# EAGLE schematic ReSpeaker 4-Mic Array for Raspberry Pi  v1.0 (EAGLE 6.4)

## Sheet 1 of 4
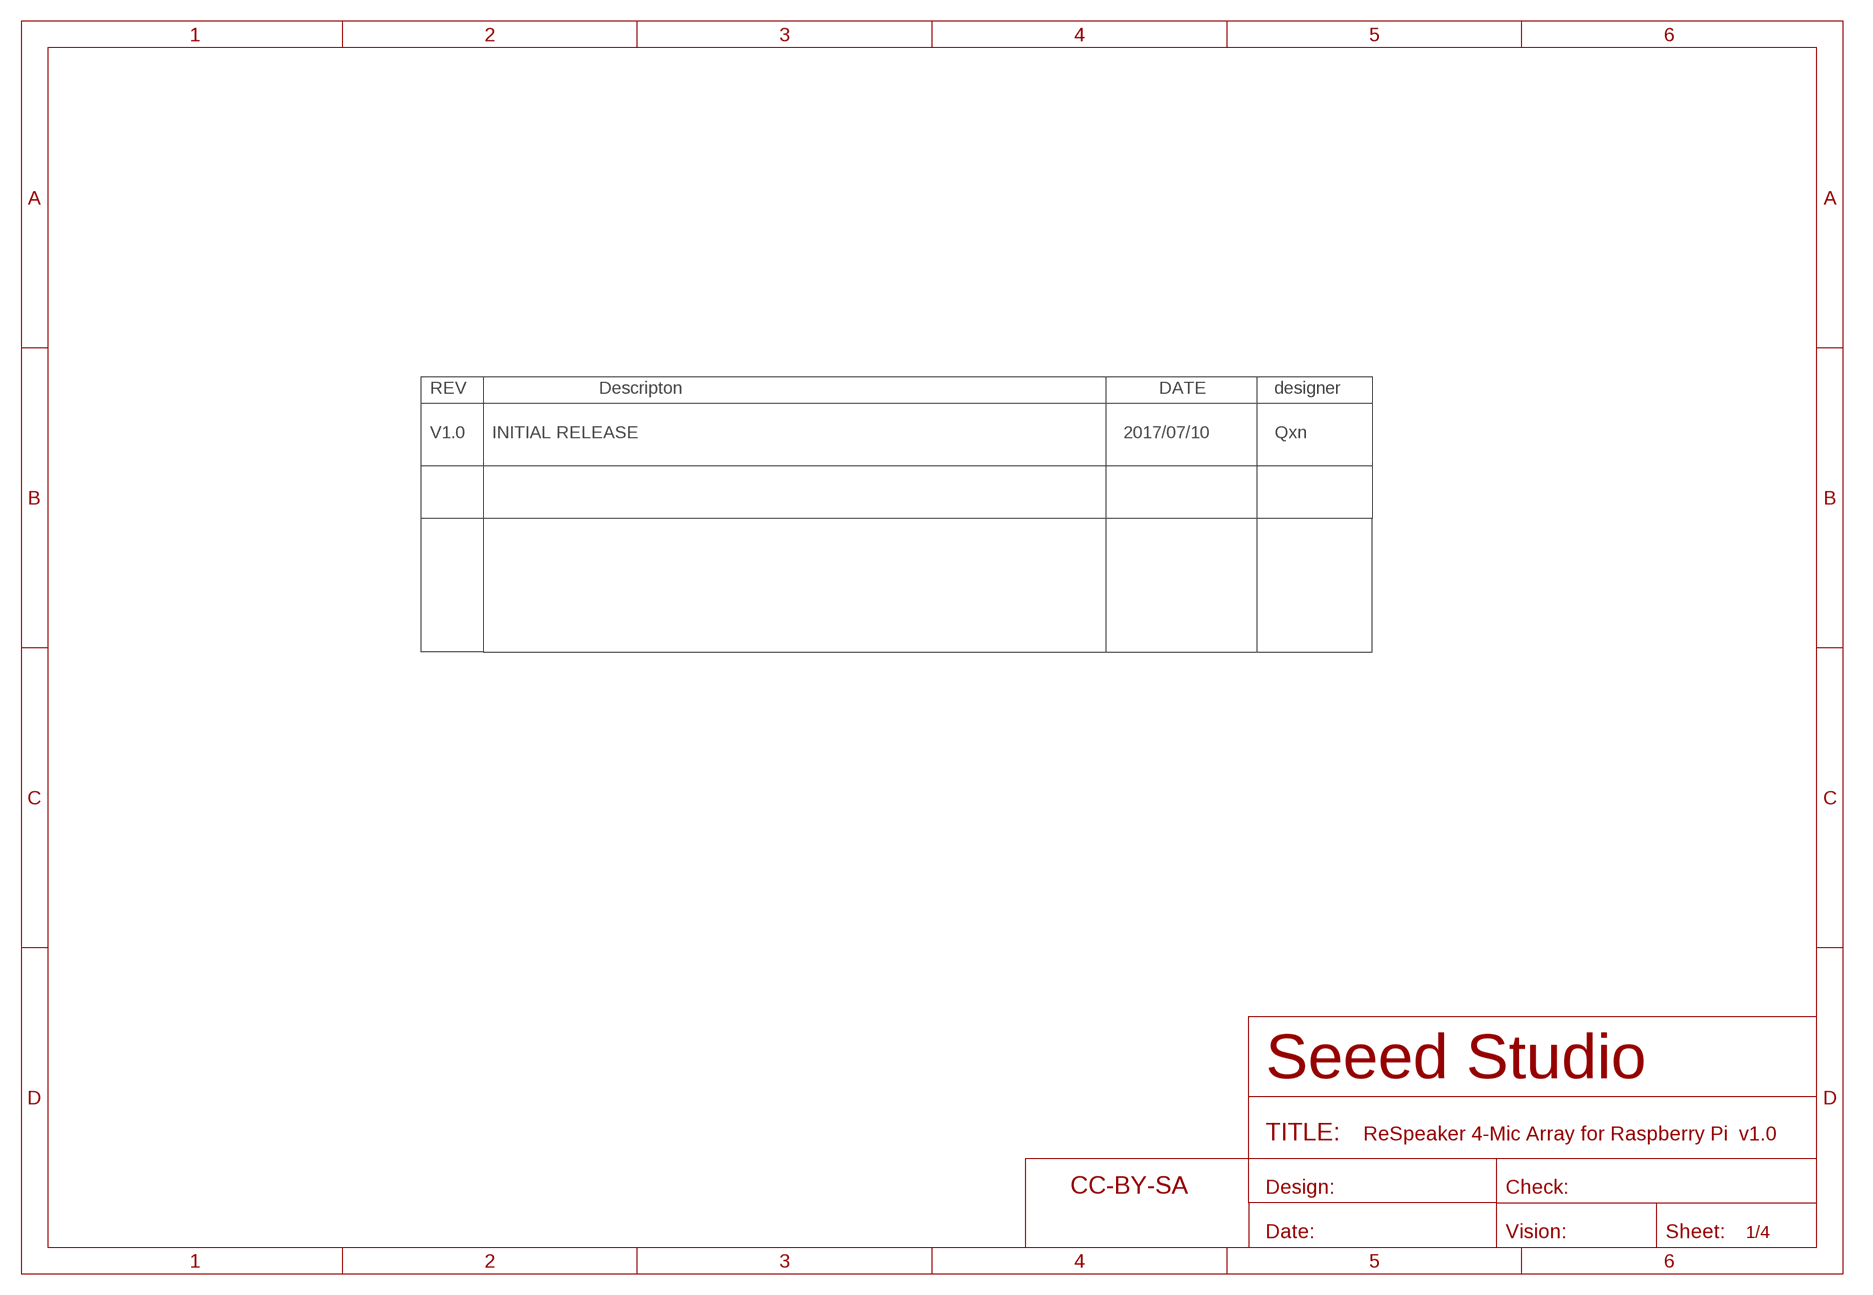
[diagram p0: schematic, sheet 1]

### Parts
FR4  SEEEDSTUDIO-OPEN-SCH-FRAME  [SEEEDSTUDIO-PCB-FRAME]

### Notes on the sheet
- REV | Descripton | DATE | designer
- V1.0 | INITIAL RELEASE | 2017/07/10 | Qxn

## Sheet 2 of 4
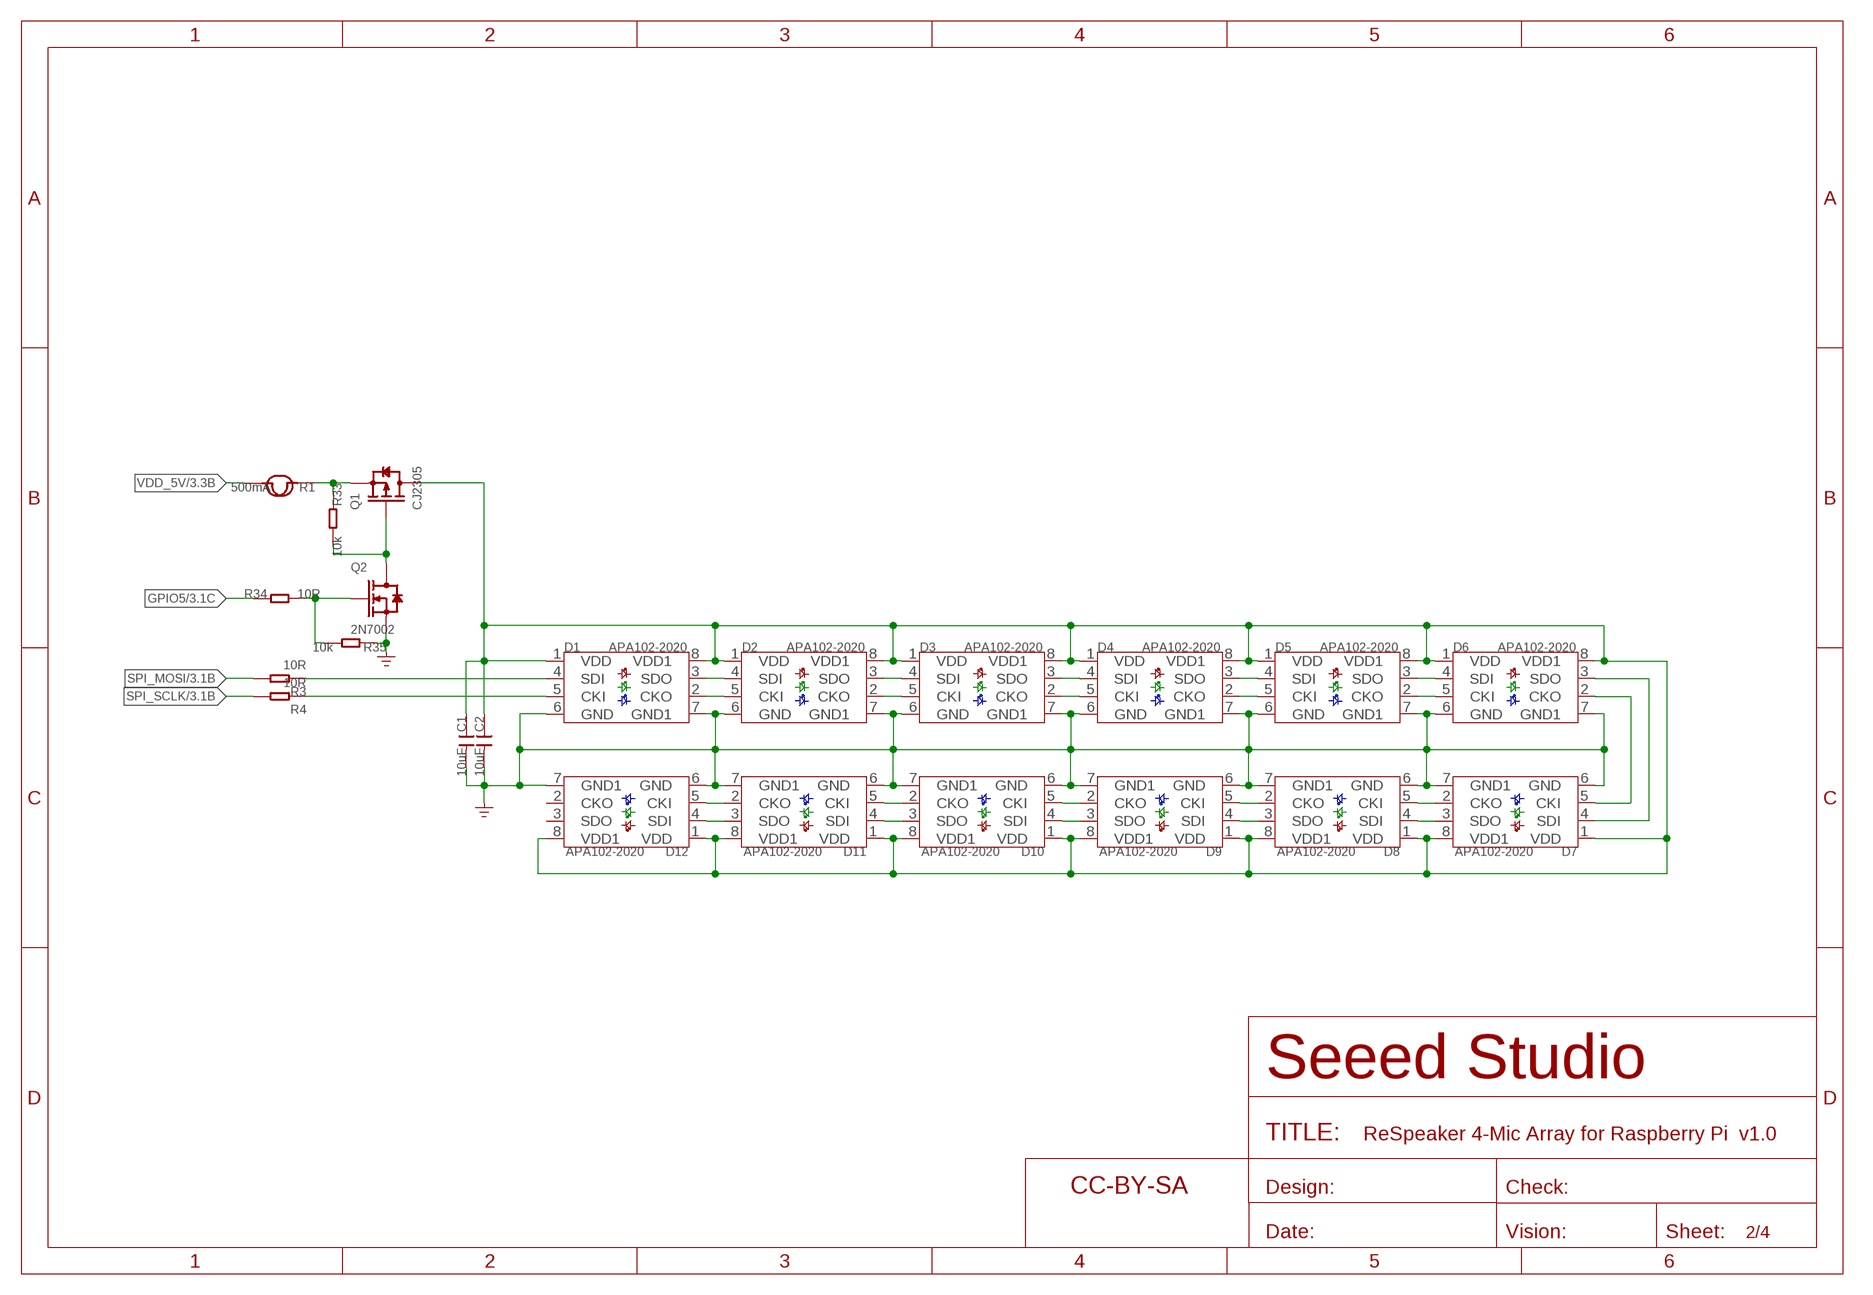
[diagram p1: schematic, sheet 2]

### Parts
C1  10uF  CAP-0603  [C0603]
C2  10uF  CAP-0603  [C0603]
D1  APA102-2020  LED-RGB-8P-APA102-2020  [RGB2020]
D2  APA102-2020  LED-RGB-8P-APA102-2020  [RGB2020]
D3  APA102-2020  LED-RGB-8P-APA102-2020  [RGB2020]
D4  APA102-2020  LED-RGB-8P-APA102-2020  [RGB2020]
D5  APA102-2020  LED-RGB-8P-APA102-2020  [RGB2020]
D6  APA102-2020  LED-RGB-8P-APA102-2020  [RGB2020]
D7  APA102-2020  LED-RGB-8P-APA102-2020  [RGB2020]
D8  APA102-2020  LED-RGB-8P-APA102-2020  [RGB2020]
D9  APA102-2020  LED-RGB-8P-APA102-2020  [RGB2020]
D10  APA102-2020  LED-RGB-8P-APA102-2020  [RGB2020]
D11  APA102-2020  LED-RGB-8P-APA102-2020  [RGB2020]
D12  APA102-2020  LED-RGB-8P-APA102-2020  [RGB2020]
FR3  SEEEDSTUDIO-OPEN-SCH-FRAME  [SEEEDSTUDIO-PCB-FRAME]
Q1  CJ2305  MOSFET-P'SI2323CDS/SI2305DS<BR>'  [SOT-23]
Q2  2N7002  MOSFET-N'SOT23'  [SOT-23]
R1  500mA  FUSE+'1206'  [FS1206]
R3  10R  RES-0402  [R0402]
R4  10R  RES-0402  [R0402]
R33  10k  RES-0402  [R0402]
R34  10R  RES-0402  [R0402]
R35  10k  RES-0402  [R0402]

### Nets
GND: C1.2 C2.2 D1.6(GND) D1.7(GND1) D2.6(GND) D2.7(GND1) D3.6(GND) D3.7(GND1) D4.6(GND) D4.7(GND1) D5.6(GND) D5.7(GND1) D6.6(GND) D6.7(GND1) D7.6(GND) D7.7(GND1) D8.6(GND) D8.7(GND1) D9.6(GND) D9.7(GND1) D10.6(GND) D10.7(GND1) D11.6(GND) D11.7(GND1) D12.6(GND) D12.7(GND1) Q2.2(S) R35.1 ; supply symbol labelled GND_POWER ; also sheet 3,4
GPIO5: R34.1 ; also sheet 3
N$1: D1.2(CKO) D2.5(CKI)
N$2: D1.4(SDI) R3.1
N$4: D1.3(SDO) D2.4(SDI)
N$5: D1.5(CKI) R4.1
N$8: D2.2(CKO) D3.5(CKI)
N$11: D2.3(SDO) D3.4(SDI)
N$15: D3.2(CKO) D4.5(CKI)
N$17: D4.2(CKO) D5.5(CKI)
N$19: D3.3(SDO) D4.4(SDI)
N$22: D4.3(SDO) D5.4(SDI)
N$23: D5.2(CKO) D6.5(CKI)
N$25: D5.3(SDO) D6.4(SDI)
N$26: D6.2(CKO) D7.5(CKI)
N$27: D6.3(SDO) D7.4(SDI)
N$28: D7.2(CKO) D8.5(CKI)
N$29: D7.3(SDO) D8.4(SDI)
N$53: D8.2(CKO) D9.5(CKI)
N$54: D8.3(SDO) D9.4(SDI)
N$55: D9.2(CKO) D10.5(CKI)
N$56: D9.3(SDO) D10.4(SDI)
N$57: Q1.2(S) R1.1 R33.1
N$58: Q1.1(G) Q2.3(D) R33.2
N$59: D10.2(CKO) D11.5(CKI)
N$60: D10.3(SDO) D11.4(SDI)
N$61: D11.2(CKO) D12.5(CKI)
N$62: D11.3(SDO) D12.4(SDI)
N$63: Q2.1(G) R34.2 R35.2
SPI_MOSI: R3.2 ; also sheet 3
SPI_SCLK: R4.2 ; also sheet 3
VDD_5V: R1.2 ; also sheet 3,4
VDD_LED: C1.1 C2.1 D1.1(VDD) D1.8(VDD1) D2.1(VDD) D2.8(VDD1) D3.1(VDD) D3.8(VDD1) D4.1(VDD) D4.8(VDD1) D5.1(VDD) D5.8(VDD1) D6.1(VDD) D6.8(VDD1) D7.1(VDD) D7.8(VDD1) D8.1(VDD) D8.8(VDD1) D9.1(VDD) D9.8(VDD1) D10.1(VDD) D10.8(VDD1) D11.1(VDD) D11.8(VDD1) D12.1(VDD) D12.8(VDD1) Q1.3(D)
Unconnected: D12.2(CKO) D12.3(SDO)

## Sheet 3 of 4
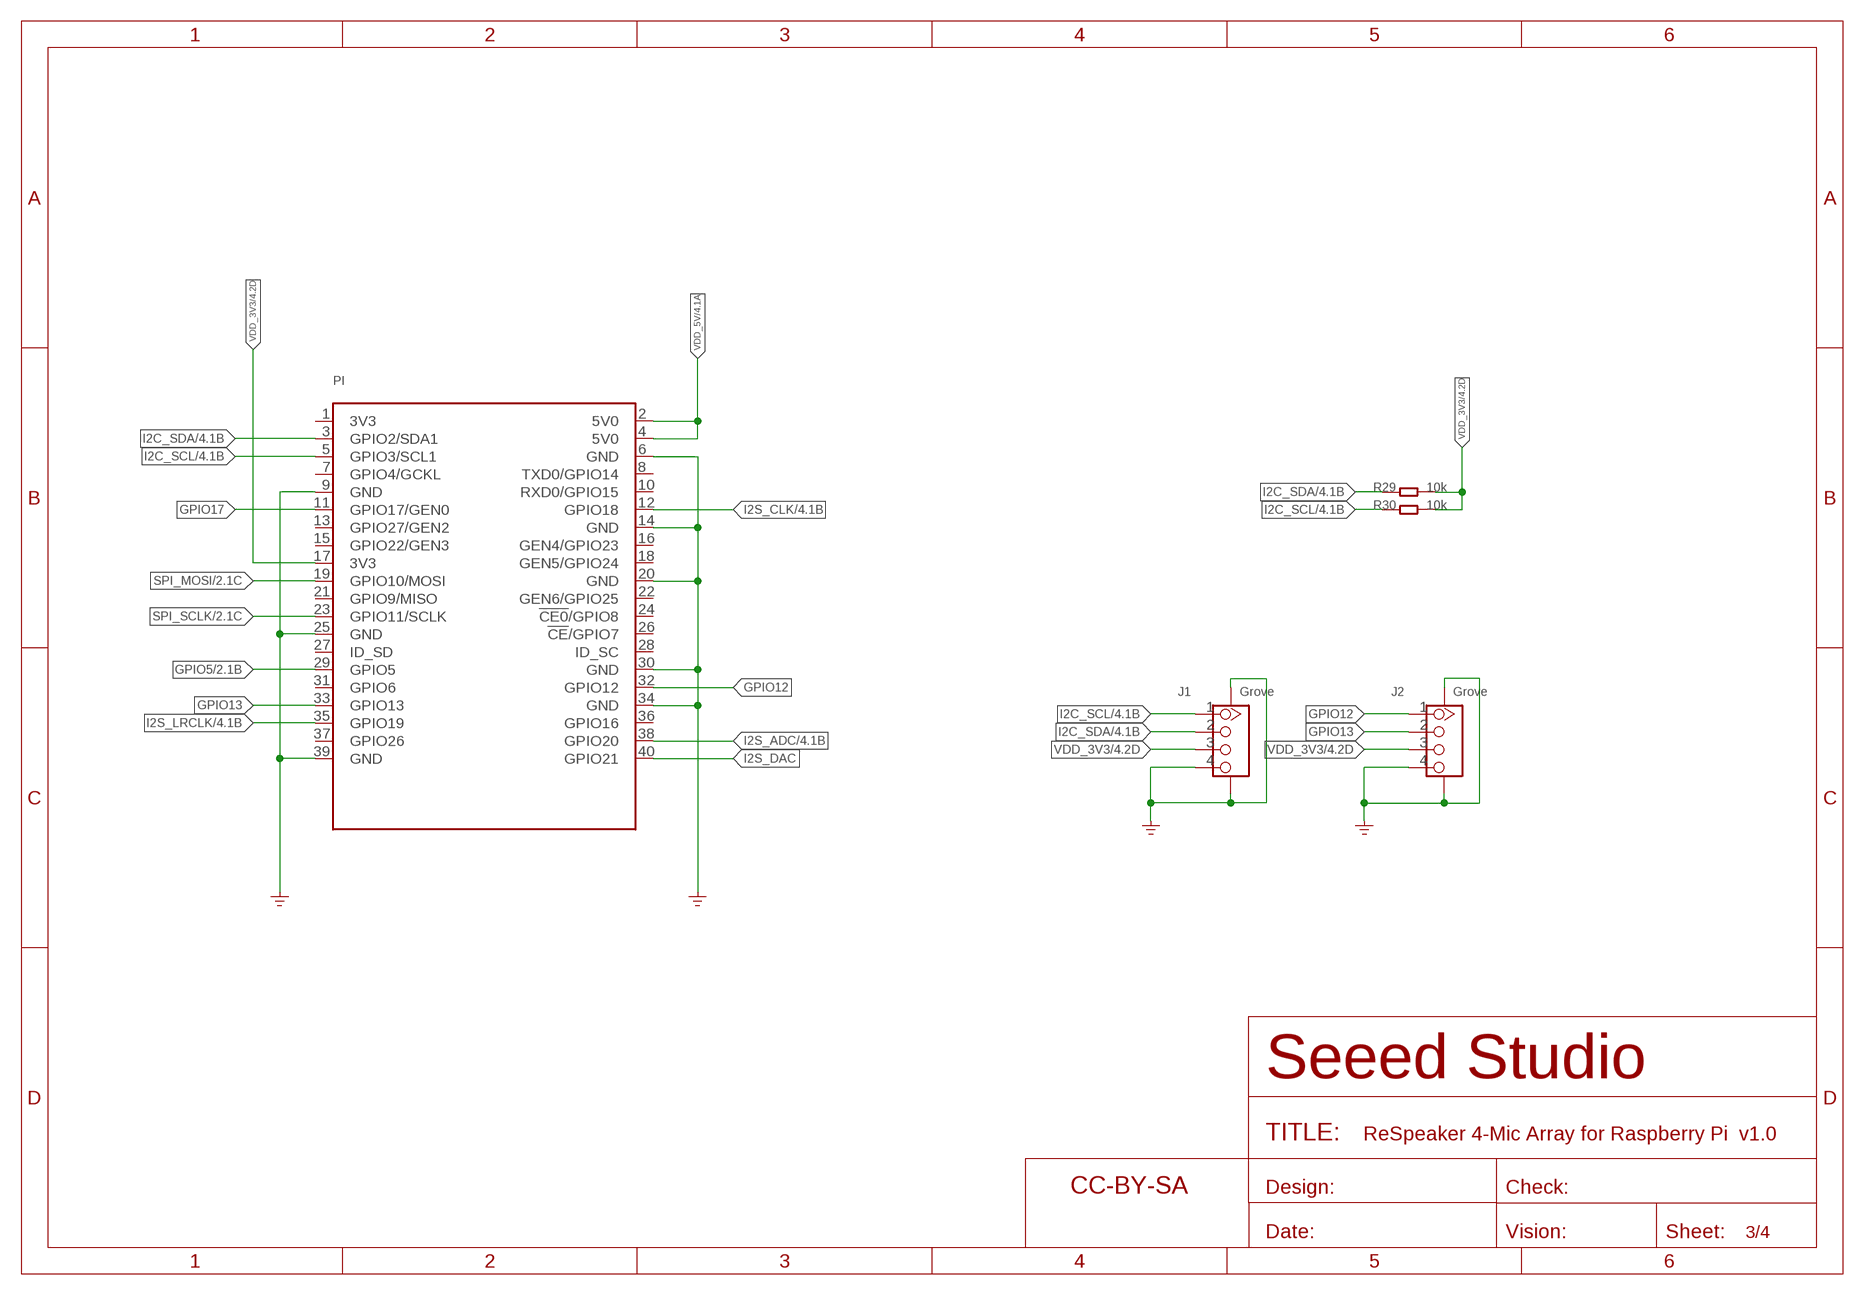
[diagram p2: schematic, sheet 3]

### Parts
FR1  SEEEDSTUDIO-OPEN-SCH-FRAME  [SEEEDSTUDIO-PCB-FRAME]
J1  Grove  GROVE-CONNECTOR-SMD'90D'  [HW4-SMD-2.0-90D]
J2  Grove  GROVE-CONNECTOR-SMD'90D'  [HW4-SMD-2.0-90D]
PI  RPI-ZERO-BOTTOM  [H2X20-SMD-2.54]
R29  10k  RES-0402  [R0402]
R30  10k  RES-0402  [R0402]

### Nets
GND: J1.4 J1.SS1 J1.SS2 J2.4 J2.SS1 J2.SS2 PI.6(GND) PI.9(GND) PI.14(GND) PI.20(GND) PI.25(GND) PI.30(GND) PI.34(GND) PI.39(GND) ; supply symbol labelled GND_POWER ; also sheet 2,4
GPIO5: PI.29(GPIO5) ; also sheet 2
GPIO12: J2.1 PI.32(GPIO12)
GPIO13: J2.2 PI.33(GPIO13)
GPIO17: PI.11(GPIO17/GEN0)
I2C_SCL: J1.1 PI.5(GPIO3/SCL1) R30.1 ; also sheet 4
I2C_SDA: J1.2 PI.3(GPIO2/SDA1) R29.1 ; also sheet 4
I2S_ADC: PI.38(GPIO20) ; also sheet 4
I2S_CLK: PI.12(GPIO18) ; also sheet 4
I2S_DAC: PI.40(GPIO21)
I2S_LRCLK: PI.35(GPIO19) ; also sheet 4
SPI_MOSI: PI.19(GPIO10/MOSI) ; also sheet 2
SPI_SCLK: PI.23(GPIO11/SCLK) ; also sheet 2
VDD_3V3: J1.3 J2.3 PI.17(3V3) R29.2 R30.2 ; also sheet 4
VDD_5V: PI.2(5V0) PI.4(5V0) ; also sheet 2,4
Unconnected: PI.1(3V3) PI.7(GPIO4/GCKL) PI.8(TXD0/GPIO14) PI.10(RXD0/GPIO15) PI.13(GPIO27/GEN2) PI.15(GPIO22/GEN3) PI.16(GEN4/GPIO23) PI.18(GEN5/GPIO24) PI.21(GPIO9/MISO) PI.22(GEN6/GPIO25) PI.24(!CE0!/GPIO8) PI.26(!CE!/GPIO7) PI.27(ID_SD) PI.28(ID_SC) PI.31(GPIO6) PI.36(GPIO16) PI.37(GPIO26)

## Sheet 4 of 4
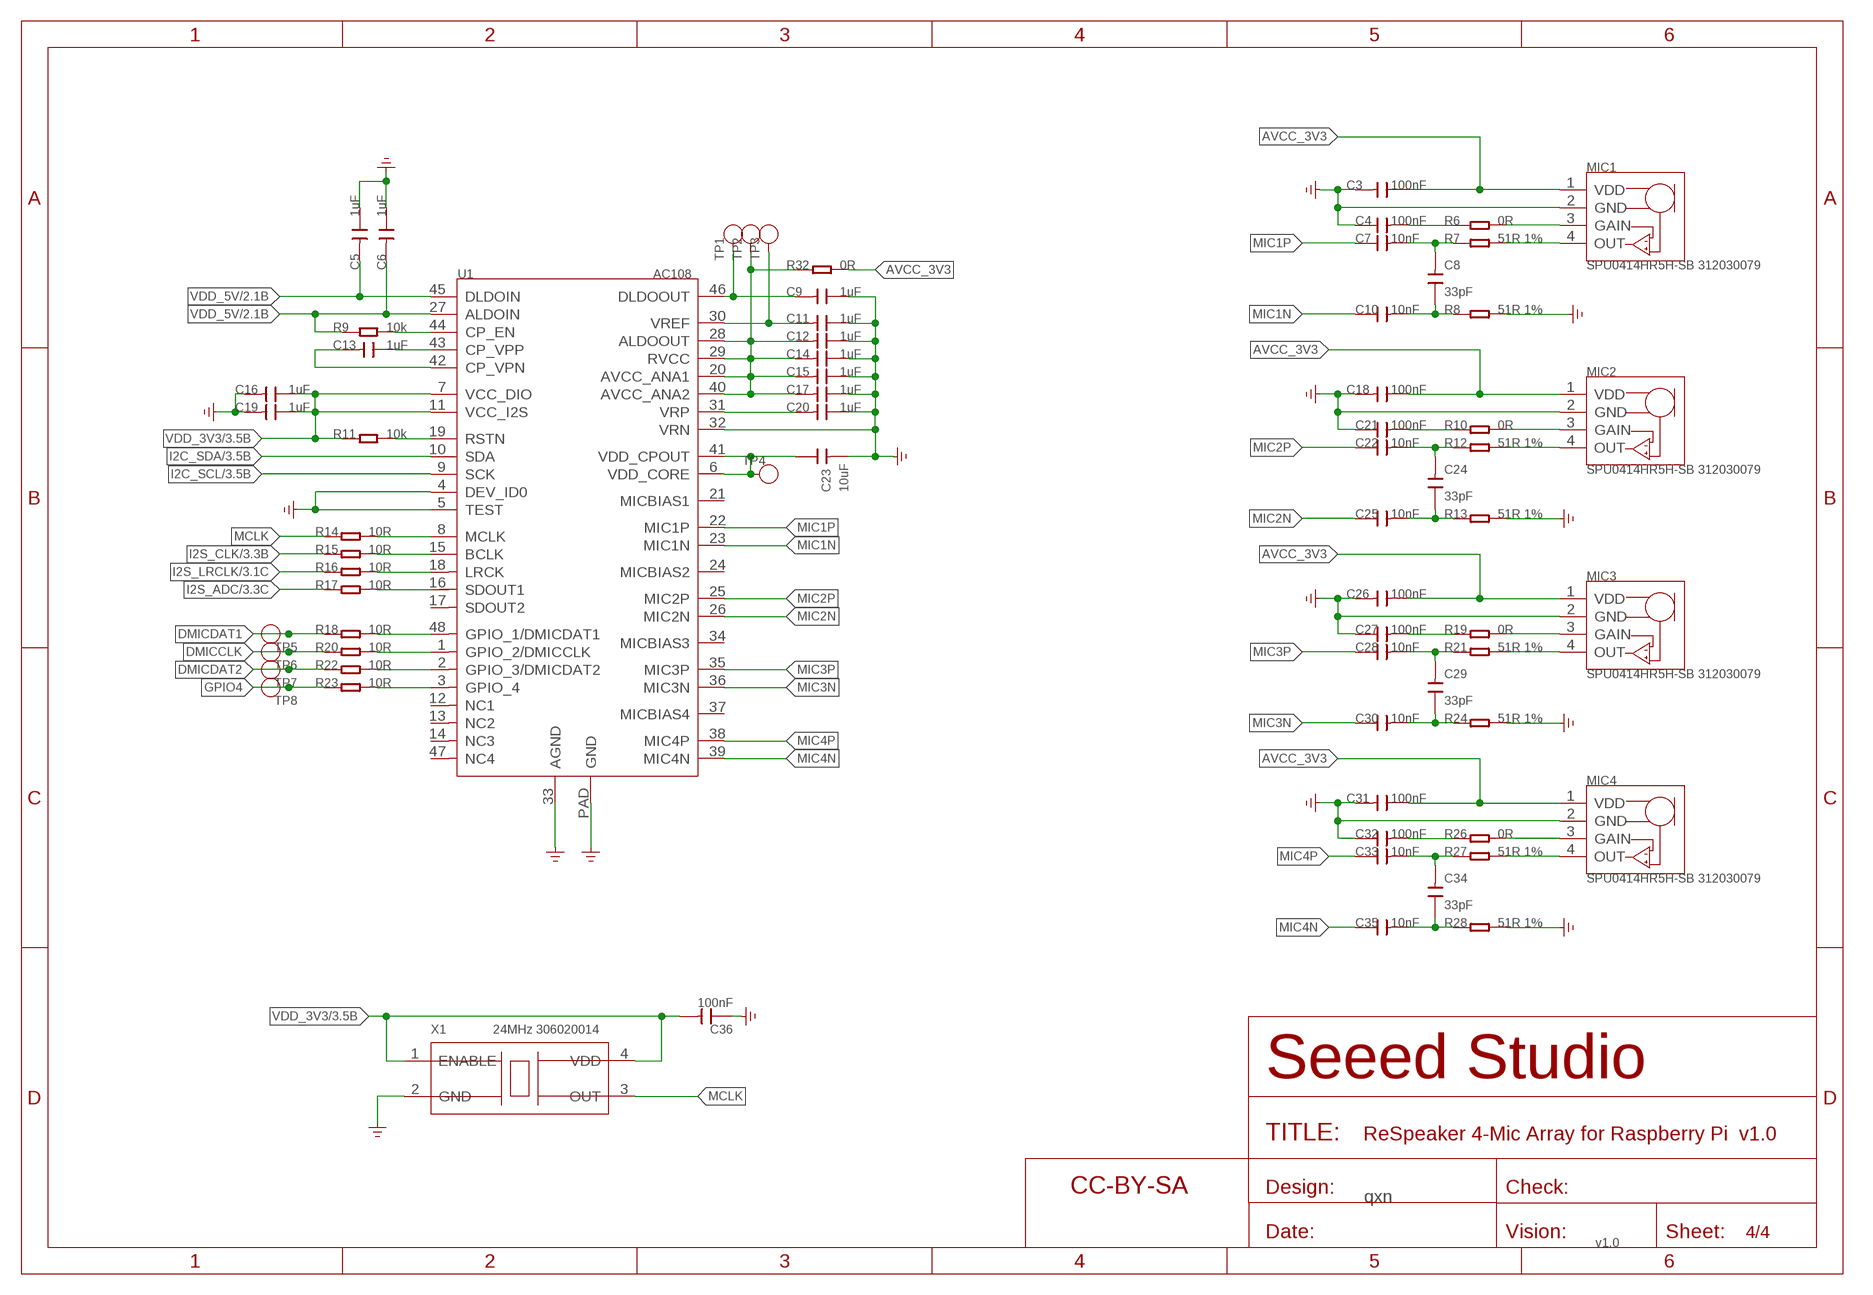
[diagram p3: schematic, sheet 4]

### Parts
C3  100nF  CAP-0402  [C0402]
C4  100nF  CAP-0402  [C0402]
C5  1uF  CAP-0402  [C0402]
C6  1uF  CAP-0402  [C0402]
C7  10nF  CAP-0402  [C0402]
C8  33pF  CAP-0402  [C0402]
C9  1uF  CAP-0402  [C0402]
C10  10nF  CAP-0402  [C0402]
C11  1uF  CAP-0402  [C0402]
C12  1uF  CAP-0402  [C0402]
C13  1uF  CAP-0402  [C0402]
C14  1uF  CAP-0402  [C0402]
C15  1uF  CAP-0402  [C0402]
C16  1uF  CAP-0402  [C0402]
C17  1uF  CAP-0402  [C0402]
C18  100nF  CAP-0402  [C0402]
C19  1uF  CAP-0402  [C0402]
C20  1uF  CAP-0402  [C0402]
C21  100nF  CAP-0402  [C0402]
C22  10nF  CAP-0402  [C0402]
C23  10uF  CAP-0603  [C0603]
C24  33pF  CAP-0402  [C0402]
C25  10nF  CAP-0402  [C0402]
C26  100nF  CAP-0402  [C0402]
C27  100nF  CAP-0402  [C0402]
C28  10nF  CAP-0402  [C0402]
C29  33pF  CAP-0402  [C0402]
C30  10nF  CAP-0402  [C0402]
C31  100nF  CAP-0402  [C0402]
C32  100nF  CAP-0402  [C0402]
C33  10nF  CAP-0402  [C0402]
C34  33pF  CAP-0402  [C0402]
C35  10nF  CAP-0402  [C0402]
C36  100nF  CAP-0402  [C0402]
FR2  SEEEDSTUDIO-OPEN-SCH-FRAME  [SEEEDSTUDIO-PCB-FRAME]
MIC1  SPU0414HR5H-SB 312030079  MICROPHONE-SPU0414HR5H-SB  [MIC4P-1.7-3.76X2.95X1.1MM]
MIC2  SPU0414HR5H-SB 312030079  MICROPHONE-SPU0414HR5H-SB  [MIC4P-1.7-3.76X2.95X1.1MM]
MIC3  SPU0414HR5H-SB 312030079  MICROPHONE-SPU0414HR5H-SB  [MIC4P-1.7-3.76X2.95X1.1MM]
MIC4  SPU0414HR5H-SB 312030079  MICROPHONE-SPU0414HR5H-SB  [MIC4P-1.7-3.76X2.95X1.1MM]
R6  0R  RES-0402  [R0402]
R7  51R 1%  RES-0402  [R0402]
R8  51R 1%  RES-0402  [R0402]
R9  10k  RES-0402  [R0402]
R10  0R  RES-0402  [R0402]
R11  10k  RES-0402  [R0402]
R12  51R 1%  RES-0402  [R0402]
R13  51R 1%  RES-0402  [R0402]
R14  10R  RES-0402  [R0402]
R15  10R  RES-0402  [R0402]
R16  10R  RES-0402  [R0402]
R17  10R  RES-0402  [R0402]
R18  10R  RES-0402  [R0402]
R19  0R  RES-0402  [R0402]
R20  10R  RES-0402  [R0402]
R21  51R 1%  RES-0402  [R0402]
R22  10R  RES-0402  [R0402]
R23  10R  RES-0402  [R0402]
R24  51R 1%  RES-0402  [R0402]
R26  0R  RES-0402  [R0402]
R27  51R 1%  RES-0402  [R0402]
R28  51R 1%  RES-0402  [R0402]
R32  0R  RES-0402  [R0402]
TP1  TEST-POINT'4545'  [TP-D45MIL]
TP2  TEST-POINT'4545'  [TP-D45MIL]
TP3  TEST-POINT'4545'  [TP-D45MIL]
TP4  TEST-POINT'4545'  [TP-D45MIL]
TP5  TEST-POINT'4080'  [TP-80X40MIL]
TP6  TEST-POINT'4080'  [TP-80X40MIL]
TP7  TEST-POINT'4080'  [TP-80X40MIL]
TP8  TEST-POINT'4080'  [TP-80X40MIL]
U1  AC108  CONVERTER-ADC-AC108  [QFN48G-0.4-6X6MM]
X1  24MHz 306020014  CRYSTAL-OSCILLATOR2.5*2.0  [OSC4-SMD-2.5X2.0X0.8MM]

### Nets
ALDO: C12.2 C14.2 C15.2 C17.2 R32.2 TP2.T U1.20(AVCC_ANA1) U1.28(ALDOOUT) U1.29(RVCC) U1.40(AVCC_ANA2)
AVCC_3V3: C3.1 C18.1 C26.1 C31.1 MIC1.1(VDD) MIC2.1(VDD) MIC3.1(VDD) MIC4.1(VDD) R32.1
DMICCLK: R20.2 TP6.1(T)
DMICDAT1: R18.2 TP5.1(T)
DMICDAT2: R22.2 TP7.1(T)
GND: C3.2 C4.1 C5.1 C6.1 C9.1 C11.1 C12.1 C14.1 C15.1 C16.2 C17.1 C18.2 C19.2 C20.1 C21.1 C23.2 C26.2 C27.1 C31.2 C32.1 C36.1 MIC1.2(GND) MIC2.2(GND) MIC3.2(GND) MIC4.2(GND) R8.1 R13.1 R24.1 R28.1 U1.4(DEV_ID0) U1.5(TEST) U1.32(VRN) U1.33(AGND) U1.PAD(GND) X1.2(GND) ; supply symbol labelled GND_POWER ; also sheet 2,3
GPIO4: R23.2 TP8.1(T)
I2C_SCL: U1.9(SCK) ; also sheet 3
I2C_SDA: U1.10(SDA) ; also sheet 3
I2S_ADC: R17.2 ; also sheet 3
I2S_CLK: R15.2 ; also sheet 3
I2S_LRCLK: R16.2 ; also sheet 3
MCLK: R14.2 X1.3(OUT)
MIC1N: C10.1 U1.23(MIC1N)
MIC1P: C7.1 U1.22(MIC1P)
MIC2N: C25.1 U1.26(MIC2N)
MIC2P: C22.1 U1.25(MIC2P)
MIC3N: C30.1 U1.36(MIC3N)
MIC3P: C28.1 U1.35(MIC3P)
MIC4N: C35.1 U1.39(MIC4N)
MIC4P: C33.1 U1.38(MIC4P)
N$3: C21.2 R10.2
N$6: MIC2.3(GAIN) R10.1
N$7: C22.2 C24.2 R12.2
N$9: C24.1 C25.2 R13.2
N$10: MIC2.4(OUT) R12.1
N$12: C27.2 R19.2
N$13: C9.2 TP1.T U1.46(DLDOOUT)
N$14: MIC3.3(GAIN) R19.1
N$16: C11.2 TP3.T U1.30(VREF)
N$18: C20.2 U1.31(VRP)
N$20: C28.2 C29.2 R21.2
N$21: C23.1 TP4.T U1.6(VDD_CORE) U1.41(VDD_CPOUT)
N$24: C4.2 R6.2
N$30: MIC1.3(GAIN) R6.1
N$31: C29.1 C30.2 R24.2
N$32: C13.1 U1.43(CP_VPP)
N$33: C13.2 U1.42(CP_VPN)
N$34: C7.2 C8.2 R7.2
N$35: MIC3.4(OUT) R21.1
N$36: C8.1 C10.2 R8.2
N$37: MIC1.4(OUT) R7.1
N$38: R9.2 U1.44(CP_EN)
N$39: R11.2 U1.19(RSTN)
N$40: C32.2 R26.2
N$41: MIC4.3(GAIN) R26.1
N$42: C33.2 C34.2 R27.2
N$43: C34.1 C35.2 R28.2
N$44: R14.1 U1.8(MCLK)
N$45: R15.1 U1.15(BCLK)
N$46: R16.1 U1.18(LRCK)
N$47: MIC4.4(OUT) R27.1
N$48: R17.1 U1.16(SDOUT1)
N$49: R18.1 U1.48(GPIO_1/DMICDAT1)
N$50: R20.1 U1.1(GPIO_2/DMICCLK)
N$51: R22.1 U1.2(GPIO_3/DMICDAT2)
N$52: R23.1 U1.3(GPIO_4)
VDD_3V3: C16.1 C19.1 C36.2 R11.1 U1.7(VCC_DIO) U1.11(VCC_I2S) X1.1(ENABLE) X1.4(VDD) ; also sheet 3
VDD_5V: C5.2 C6.2 R9.1 U1.27(ALDOIN) U1.45(DLDOIN) ; also sheet 2,3
Unconnected: U1.12(NC1) U1.13(NC2) U1.14(NC3) U1.17(SDOUT2) U1.21(MICBIAS1) U1.24(MICBIAS2) U1.34(MICBIAS3) U1.37(MICBIAS4) U1.47(NC4)

### Notes on the sheet
- qxn
- v1.0

## Library data of the parts
C1-C36 = Discrete-new:CAP: Ceramic Capacitors
D1-D12 = Discrete-new:LED-RGB-8P-APA102-2020
FR1-FR4 = moudle-new:SEEEDSTUDIO-OPEN-SCH-FRAME
J1 J2 = Connector-new:GROVE-CONNECTOR-SMD: 4P-SMD-2.0:320110030;4P-SMD-2.0-90D:320110032
MIC1-MIC4 = Discrete-new:MICROPHONE-SPU0414HR5H-SB: 312030079
PI = IC-new:RPI-ZERO
Q1 = Discrete-new:MOSFET-P
Q2 = Discrete-new:MOSFET-N
R1 = Discrete-new:FUSE+
R3 R4 R6-R24 R26-R30 R32-R35 = Discrete-new:RES
TP1-TP4 = Discrete-new:TEST-POINT; PARTNO: DNP
TP5-TP8 = Discrete-new:TEST-POINT
U1 = IC-new:CONVERTER-ADC-AC108
X1 = Discrete-new:CRYSTAL-OSCILLATOR